# Altium schematic sheet BrakeLight2024.SchDoc
size A4; SheetNumber: 1; SheetTotal: 1
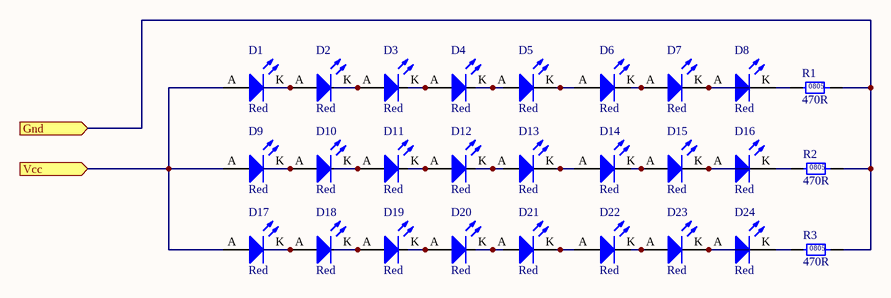
[diagram p0: BrakeLight2024.SchDoc]

## Parts
D1  Red  [0805 LED]
D2  Red  [0805 LED]
D3  Red  [0805 LED]
D4  Red  [0805 LED]
D5  Red  [0805 LED]
D6  Red  [0805 LED]
D7  Red  [0805 LED]
D8  Red  [0805 LED]
D9  Red  [0805 LED]
D10  Red  [0805 LED]
D11  Red  [0805 LED]
D12  Red  [0805 LED]
D13  Red  [0805 LED]
D14  Red  [0805 LED]
D15  Red  [0805 LED]
D16  Red  [0805 LED]
D17  Red  [0805 LED]
D18  Red  [0805 LED]
D19  Red  [0805 LED]
D20  Red  [0805 LED]
D21  Red  [0805 LED]
D22  Red  [0805 LED]
D23  Red  [0805 LED]
D24  Red  [0805 LED]
R1  470R  [0805]
R2  470R  [0805]
R3  470R  [0805]

## Ports
Gnd (in), Vcc (in)

## Nets
Gnd: R1.2 R2.2 R3.2 ; port Gnd
Vcc: D1.A D9.A D17.A ; port Vcc
NetD1_K: D1.K D2.A
NetD2_K: D2.K D3.A
NetD3_K: D3.K D4.A
NetD4_K: D4.K D5.A
NetD5_K: D5.K D6.A
NetD6_K: D6.K D7.A
NetD7_K: D7.K D8.A
NetD8_K: D8.K R1.1
NetD9_K: D9.K D10.A
NetD10_K: D10.K D11.A
NetD11_K: D11.K D12.A
NetD12_K: D12.K D13.A
NetD13_K: D13.K D14.A
NetD14_K: D14.K D15.A
NetD15_K: D15.K D16.A
NetD16_K: D16.K R2.1
NetD17_K: D17.K D18.A
NetD18_K: D18.K D19.A
NetD19_K: D19.K D20.A
NetD20_K: D20.K D21.A
NetD21_K: D21.K D22.A
NetD22_K: D22.K D23.A
NetD23_K: D23.K D24.A
NetD24_K: D24.K R3.1

## Notes on the sheet
- (in symbol RC0805FR07470RL) 0805

## Library data of the parts
D1-D24 = SML-210LTT86: Red LED Indication - Discrete 1.75V 0805 (2012 Metric); Manufacturer: ROHM Semiconductor; Part Number: SML-210LTT86; Colour: Red; Digikey Part Number: 511-1286-1-ND
R1-R3 = RC0805FR07470RL: Manufacturer: YAGEO; Tolerance: 0.01; Rated Power: 0.125W; Part Number: RC0805FR07470RL; Value: 470R; Material: FR-07; Digikey Part Number: 311-470CRCT-ND